# EAGLE design adapter (EAGLE 7.2.0)
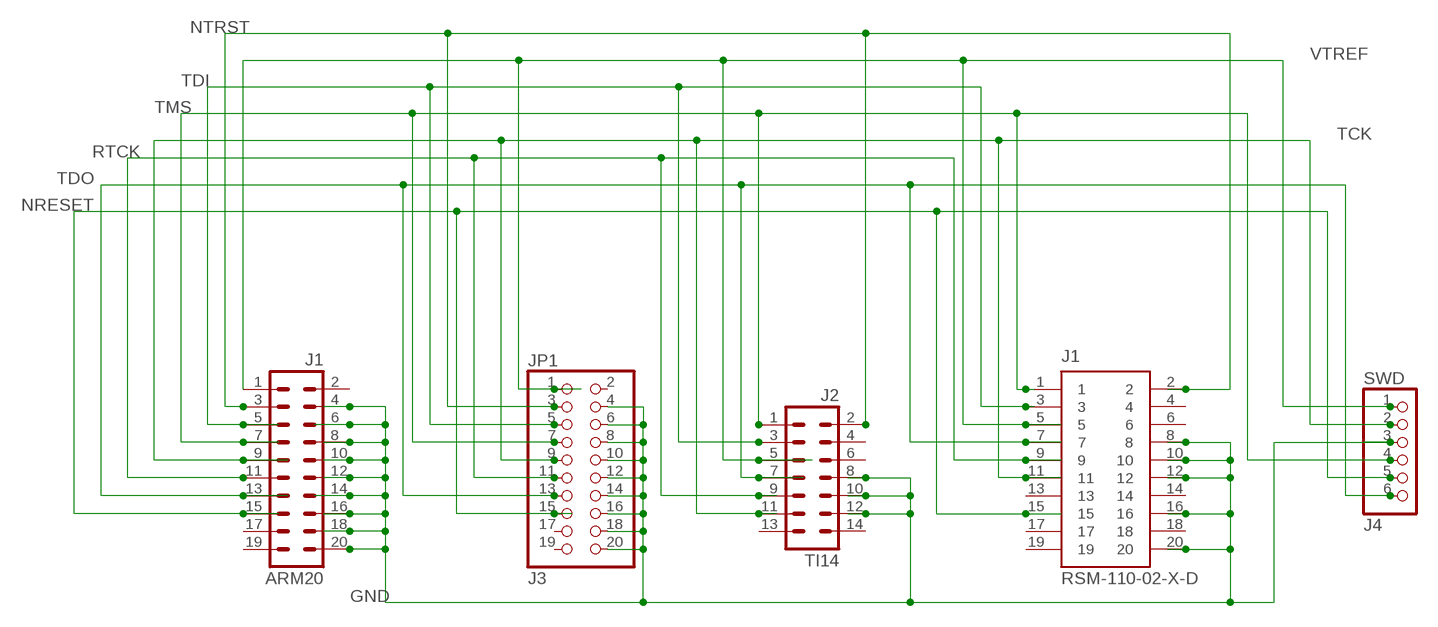
[diagram p0: schematic, sheet 1]

## Parts
ARM20  J1  ML20  [ML20]
J1  RSM-110-02-X-D  [RSM-110-02-X-D]
JP1  J3  PINHD-2X10  [2X10]
SWD  J4  PINHD-1X6  [1X06]
TI14  J2  ML14  [ML14]

## Nets
GND: ARM20.4 ARM20.6 ARM20.8 ARM20.10 ARM20.12 ARM20.14 ARM20.16 ARM20.18 ARM20.20 J1.8 J1.10 J1.12 J1.16 J1.20 JP1.4 JP1.6 JP1.8 JP1.10 JP1.12 JP1.14 JP1.16 JP1.18 JP1.20 SWD.3 TI14.8 TI14.10 TI14.12
NRESET: ARM20.15 J1.15 JP1.15 SWD.5
NTRST: ARM20.3 J1.2 JP1.3 TI14.2
RTCK: ARM20.11 J1.9 JP1.11 TI14.9
TCK: ARM20.9 J1.11 JP1.9 SWD.2 TI14.11
TDI: ARM20.5 J1.3 JP1.5 TI14.3
TDO: ARM20.13 J1.7 JP1.13 SWD.6 TI14.7
TMS: ARM20.7 J1.1 JP1.7 SWD.4 TI14.1
VTREF: ARM20.1 J1.5 JP1.1 SWD.1 TI14.5
Unconnected: ARM20.2 ARM20.17 ARM20.19 J1.4 J1.6 J1.13 J1.14 J1.17 J1.18 J1.19 JP1.2 JP1.17 JP1.19 TI14.4 TI14.6 TI14.13 TI14.14

## Library data of the parts
ARM20 = con-harting-ml:ML20: HARTING; OC_FARNELL: unknown; OC_NEWARK: unknown
J1 = RSM-110-02-X-D:RSM-110-02-X-D: Receptacle surface mount
JP1 = pinhead:PINHD-2X10: PIN HEADER
SWD = pinhead:PINHD-1X6: PIN HEADER
TI14 = con-harting-ml:ML14: HARTING; OC_FARNELL: unknown; OC_NEWARK: unknown

## Board
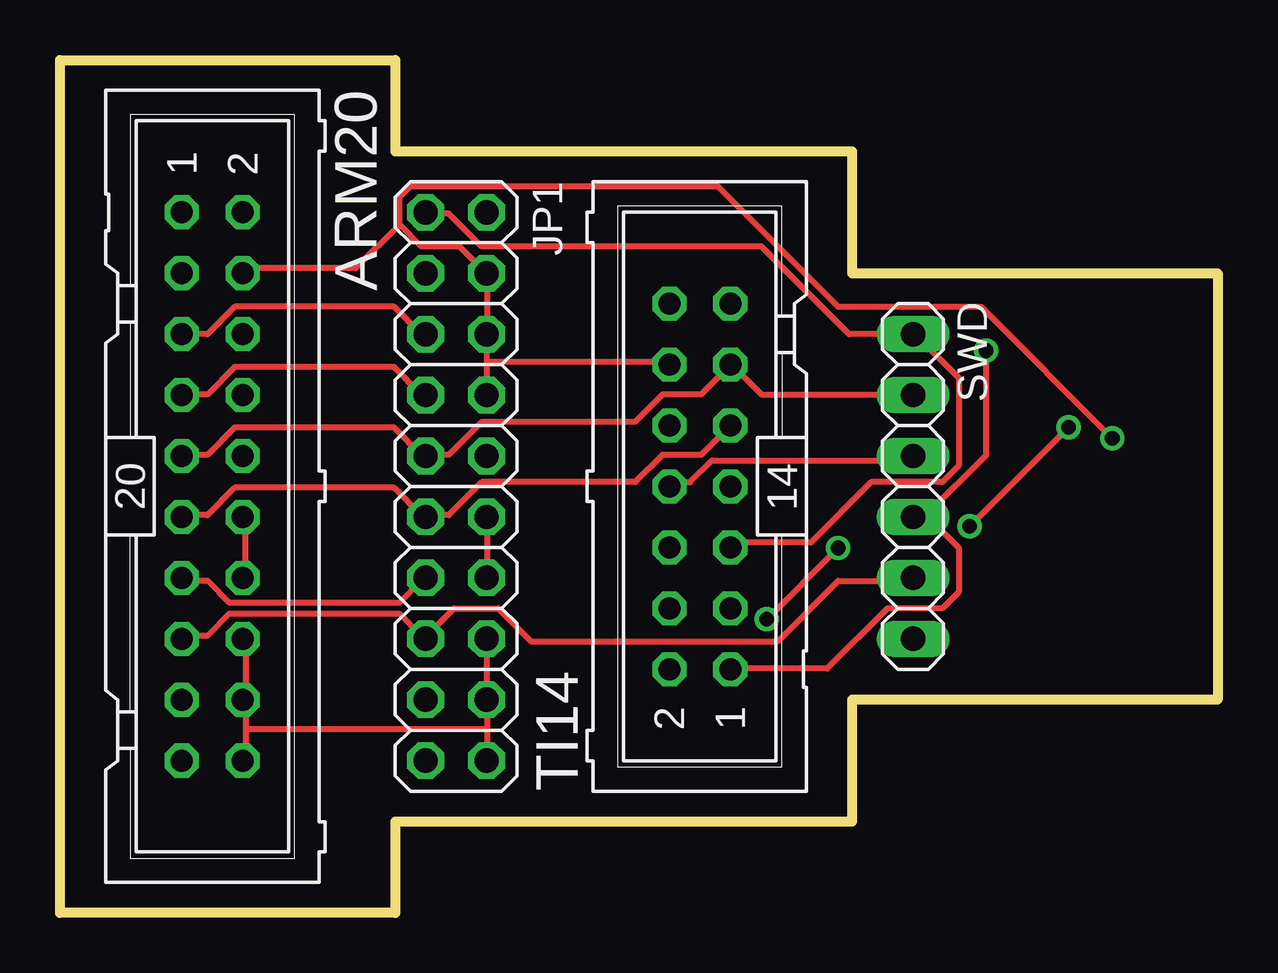
[diagram p1: board, top side]
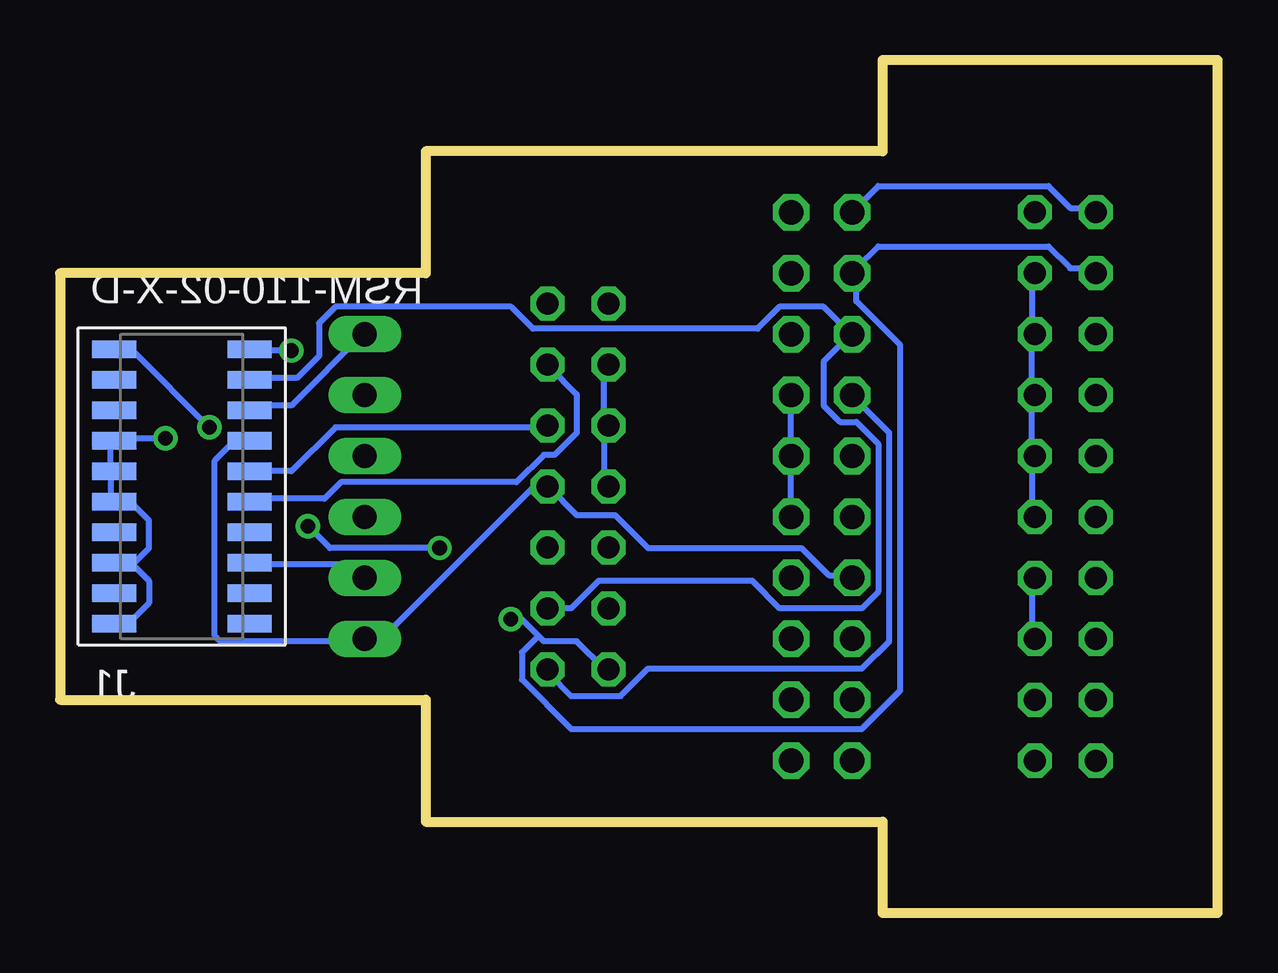
[diagram p2: board, bottom side, seen from below]

Size 48.26 x 35.56 mm. Coordinates in mm from the lower left corner, seen from the top.
Outline: 0,35.56 13.97,35.56 13.97,31.75 33.02,31.75 33.02,26.67 48.26,26.67 48.26,8.89 33.02,8.89 33.02,3.81 13.97,3.81 13.97,0 0,0 0,35.56
Copper layers (1*16): Top 0.035mm / dielectric 1.5mm / Bottom 0.035mm
Design rules "default": minimum track width 10mil, minimum drill 24mil, track to track 8mil, track to pad 8mil, pad to pad 8mil, via to via 8mil, smd to smd 8mil, copper to edge 40mil, drill to drill 8mil, minimum pad ring 10mil, minimum via ring 8mil, stop-mask expansion 4mil, vias tented up to drill 0mil, thermal gap 10mil

### Footprints (pad centres in the part's own frame; a part is rotated, then mirrored left to right if it is on the bottom)
ML20 = drill 0.914 octagon: 1 -11.43,-1.27; 2 -11.43,1.27; 3 -8.89,-1.27; 4 -8.89,1.27; 5 -6.35,-1.27; 6 -6.35,1.27; 7 -3.81,-1.27; 8 -3.81,1.27; 9 -1.27,-1.27; 10 -1.27,1.27; 11 1.27,-1.27; 12 1.27,1.27; 13 3.81,-1.27; 14 3.81,1.27; 15 6.35,-1.27; 16 6.35,1.27; 17 8.89,-1.27; 18 8.89,1.27; 19 11.43,-1.27; 20 11.43,1.27
RSM-110-02-X-D = smd 1.841 x 0.737 bottom: 1 2.826,-5.715; 2 -2.826,-5.715; 3 2.826,-4.445; 4 -2.826,-4.445; 5 2.826,-3.175; 6 -2.826,-3.175; 7 2.826,-1.905; 8 -2.826,-1.905; 9 2.826,-0.635; 10 -2.826,-0.635; 11 2.826,0.635; 12 -2.826,0.635; 13 2.826,1.905; 14 -2.826,1.905; 15 2.826,3.175; 16 -2.826,3.175; 17 2.826,4.445; 18 -2.826,4.445; 19 2.826,5.715; 20 -2.826,5.715
2X10 = drill 1.016 octagon: 1 -11.43,-1.27; 2 -11.43,1.27; 3 -8.89,-1.27; 4 -8.89,1.27; 5 -6.35,-1.27; 6 -6.35,1.27; 7 -3.81,-1.27; 8 -3.81,1.27; 9 -1.27,-1.27; 10 -1.27,1.27; 11 1.27,-1.27; 12 1.27,1.27; 13 3.81,-1.27; 14 3.81,1.27; 15 6.35,-1.27; 16 6.35,1.27; 17 8.89,-1.27; 18 8.89,1.27; 19 11.43,-1.27; 20 11.43,1.27
1X06 = drill 1.016 long: 1 -6.35,0; 2 -3.81,0; 3 -1.27,0; 4 1.27,0; 5 3.81,0; 6 6.35,0
ML14 = drill 0.914 octagon: 1 -7.62,-1.27; 2 -7.62,1.27; 3 -5.08,-1.27; 4 -5.08,1.27; 5 -2.54,-1.27; 6 -2.54,1.27; 7 0,-1.27; 8 0,1.27; 9 2.54,-1.27; 10 2.54,1.27; 11 5.08,-1.27; 12 5.08,1.27; 13 7.62,-1.27; 14 7.62,1.27

### Placement (x,y rotation side)
ARM20  6.35,17.78 270 top
J1  43.18,17.78 180 top
JP1  16.51,17.78 270 top
SWD  35.56,17.78 270 top
TI14  26.67,17.78 90 top

### Tracks (layer width: path | path; a pad name or v marks a point on that pad's centre or on a via)
GND  (via drill 0.61)
  Top 0.254: 17.8,7.67 17.8,8.81 JP1.18 17.8,9.04 17.8,11.33 JP1.16 | 17.8,7.67 17.8,6.53 JP1.20 | 7.75,7.67 7.75,8.81 ARM20.18 7.75,9.04 7.75,11.33 ARM20.16 | 7.75,7.67 7.75,6.53 ARM20.20 | 7.75,7.67 17.8,7.67 | ARM20.12 7.75,16.36 7.75,14.07 ARM20.14 | SWD.3 35.41,18.87 27.18,18.87 26.26,17.96 25.58,17.96 TI14.8 | 17.8,24.13 17.8,26.64 JP1.4 16.66,27.79 15.06,27.79 14.15,28.7 | JP1.14 17.8,14.07 17.8,16.36 JP1.12 | 17.8,22.99 17.8,21.61 JP1.8 | 17.8,22.99 17.8,24.13 | 17.8,24.13 JP1.6 | v43.87,19.79 38.38,25.27 32.44,25.27 27.41,30.3 14.6,30.3 14.15,29.84 14.15,28.7 | 17.8,22.99 25.35,22.99 TI14.12 | 14.15,28.7 12.32,26.87 7.75,26.87 ARM20.4
  Bottom 0.254: 7.75,24.13 7.75,26.64 ARM20.4 | ARM20.12 7.75,16.59 7.75,18.87 ARM20.10 7.75,19.1 7.75,21.39 ARM20.8 7.75,21.61 7.75,24.13 | 7.75,24.13 ARM20.6 | ARM20.16 7.75,11.56 7.75,13.84 ARM20.14 | TI14.8 25.58,17.96 25.58,20.24 TI14.10 25.58,20.47 25.58,22.76 TI14.12 | 46.15,18.41 46.15,17.27 J1.12 45.92,17.04 45.24,17.04 44.55,16.36 44.55,15.21 45.24,14.53 | 46.15,18.41 46.15,19.56 J1.8 45.92,19.79 v43.87,19.79 | 46.15,18.41 J1.10 | 45.24,14.53 44.55,13.84 44.55,12.93 45.24,12.24 45.92,12.24 J1.20 | 45.24,14.53 45.92,14.53 J1.16 45.24,14.53 | JP1.8 17.8,21.39 17.8,19.1 JP1.10 17.8,18.87 17.8,16.59 JP1.12
NRESET
  Top 0.254: ARM20.15 5.23,11.56 6.15,11.56 7.06,12.47 14.15,12.47 15.06,11.56 JP1.15 15.29,11.56 16.43,12.7 18.26,12.7 19.63,11.33 29.92,11.33 32.44,13.84 35.41,13.84 SWD.5
  Bottom 0.254: J1.15 40.21,14.53 36.09,14.53 35.64,14.07 SWD.5
NTRST  (via drill 0.61)
  Top 0.254: v37.92,16.13 v42.04,20.24 | v29.46,12.24 v32.44,15.21
  Bottom 0.254: ARM20.3 5.23,26.87 6.15,26.87 7.06,27.79 14.15,27.79 15.06,26.87 JP1.3 15.06,26.64 15.06,25.5 13.23,23.67 13.23,9.27 14.83,7.67 26.95,7.67 29.01,9.73 29.01,10.87 28.32,11.56 | v42.04,20.24 45.24,23.44 45.92,23.44 J1.2 | v37.92,16.13 37.01,15.21 v32.44,15.21 | v29.46,12.24 29.01,12.24 28.32,11.56 | 28.32,11.56 28.09,11.33 26.72,11.33 25.58,10.18 TI14.2
RTCK
  Top 0.254: ARM20.11 5.23,16.59 6.15,16.59 7.29,17.73 13.92,17.73 15.06,16.59 JP1.11 15.29,16.59 16.2,16.59 17.58,17.96 23.98,17.96 25.12,19.1 26.72,19.1 TI14.9
  Bottom 0.254: J1.9 38.61,18.41 36.78,20.24 28.09,20.24 TI14.9
TCK
  Top 0.254: ARM20.9 5.23,19.1 6.15,19.1 7.29,20.24 13.92,20.24 15.06,19.1 JP1.9 15.29,19.1 16.2,19.1 17.58,20.47 23.98,20.47 25.12,21.61 26.72,21.61 27.86,22.76 TI14.11 28.09,22.76 29.23,21.61 35.41,21.61 SWD.2
  Bottom 0.254: J1.11 40.21,17.27 37.24,17.27 36.55,17.96 29.23,17.96 28.09,19.1 27.63,19.1 26.72,20.01 26.72,21.61 27.86,22.76 TI14.11
TDI
  Top 0.254: ARM20.5 6.15,24.13 7.29,25.27 13.92,25.27 15.06,24.13 JP1.5
  Bottom 0.254: 15.29,24.13 16.43,25.27 18.26,25.27 19.18,24.36 28.55,24.36 29.46,25.27 36.78,25.27 37.46,24.59 37.46,23.22 38.38,22.3 40.21,22.3 J1.3 | TI14.3 26.95,12.7 25.81,13.84 19.41,13.84 18.26,12.7 14.83,12.7 14.15,13.39 14.15,19.56 15.06,20.47 15.75,20.47 16.43,21.16 16.43,22.99 15.29,24.13 | 15.29,24.13 JP1.5
TDO
  Top 0.254: ARM20.13 5.23,13.84 6.15,13.84 7.06,12.93 14.15,12.93 15.06,13.84 JP1.13
  Bottom 0.254: J1.7 40.44,19.56 41.12,19.56 41.81,18.87 41.81,11.56 41.58,11.33 35.64,11.33 SWD.6 35.41,11.56 34.72,11.56 28.55,17.73 28.09,17.73 TI14.7 27.86,17.73 26.72,16.59 25.12,16.59 23.75,15.21 17.35,15.21 16.2,14.07 15.29,14.07 JP1.13
TMS  (via drill 0.61)
  Top 0.254: ARM20.7 5.23,21.61 6.15,21.61 7.29,22.76 13.92,22.76 15.06,21.61 JP1.7 | v38.61,23.44 38.61,19.1 36.09,16.59 | 36.09,16.59 35.64,16.59 SWD.4 36.09,16.59 | 36.09,16.59 37.46,15.21 37.46,13.39 36.78,12.7 34.49,12.7 31.98,10.18 28.09,10.18 TI14.1
  Bottom 0.254: v38.61,23.44 40.21,23.44 J1.1 | JP1.7 15.06,21.39 13.69,20.01 13.69,11.33 14.83,10.18 23.75,10.18 24.89,9.04 26.95,9.04 27.86,9.96 TI14.1
VTREF
  Top 0.254: TI14.5 28.09,15.44 31.29,15.44 33.81,17.96 36.78,17.96 37.46,18.64 37.46,22.3 35.64,24.13 SWD.1 32.89,24.13 29.23,27.79 17.58,27.79 16.2,29.16 15.29,29.16 JP1.1
  Bottom 0.254: JP1.1 14.15,30.3 7.06,30.3 6.15,29.39 5.23,29.39 ARM20.1 | J1.5 40.21,21.16 38.61,21.16 35.64,24.13 SWD.1